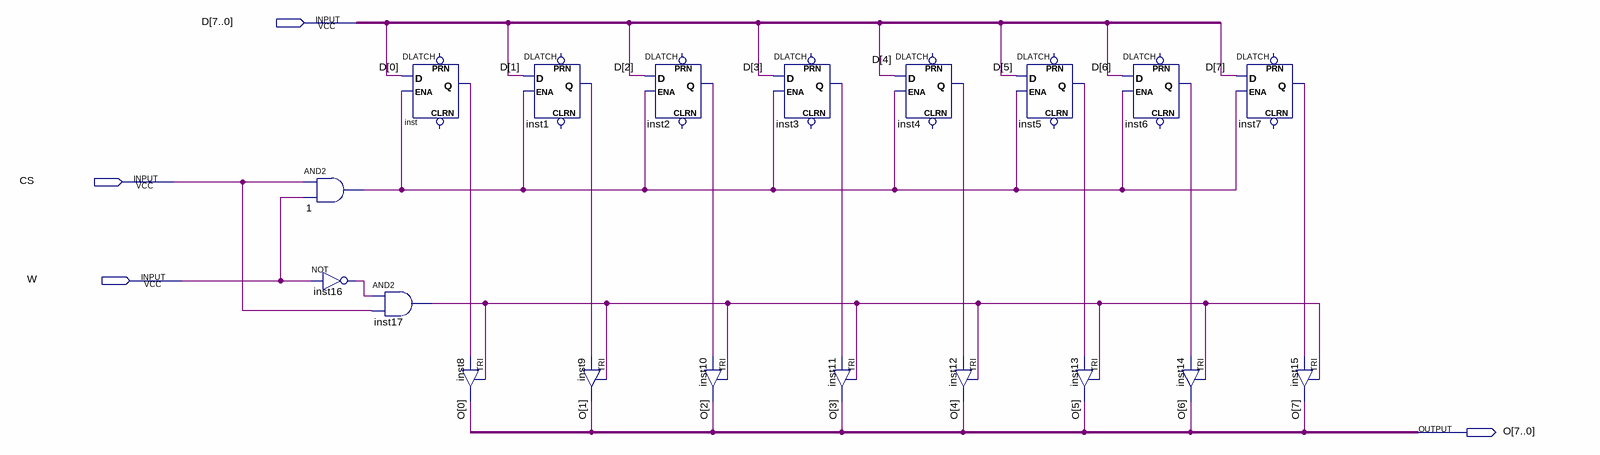
[diagram p0: schematic sheet]
// Quartus schematic WORD8BIT.bdf as structural Verilog: 19 symbols, 4 pins
module WORD8BIT (
  input  [7:0] D,
  input  CS,
  input  W,
  output [7:0] O
);

  wire inst1_q, inst2_q, inst3_q, inst4_q, inst5_q, inst6_q, inst7_q, inst16_out, inst17_out, inst_q, n1_out;

  and u_1 (n1_out, CS, W);
  not inst16 (inst16_out, W);
  and inst17 (inst17_out, inst16_out, CS);
  DLATCH inst (.D(D[0]), .ENA(n1_out), .Q(inst_q));  // open: CLRN, PRN
  TRI inst8 (.IN(inst_q), .OE(inst17_out), .OUT(O[0]));
  DLATCH inst1 (.D(D[1]), .ENA(n1_out), .Q(inst1_q));  // open: CLRN, PRN
  TRI inst9 (.IN(inst1_q), .OE(inst17_out), .OUT(O[1]));
  DLATCH inst2 (.D(D[2]), .ENA(n1_out), .Q(inst2_q));  // open: CLRN, PRN
  TRI inst10 (.IN(inst2_q), .OE(inst17_out), .OUT(O[2]));
  DLATCH inst3 (.D(D[3]), .ENA(n1_out), .Q(inst3_q));  // open: CLRN, PRN
  TRI inst11 (.IN(inst3_q), .OE(inst17_out), .OUT(O[3]));
  DLATCH inst4 (.D(D[4]), .ENA(n1_out), .Q(inst4_q));  // open: CLRN, PRN
  TRI inst12 (.IN(inst4_q), .OE(inst17_out), .OUT(O[4]));
  DLATCH inst5 (.D(D[5]), .ENA(n1_out), .Q(inst5_q));  // open: CLRN, PRN
  TRI inst13 (.IN(inst5_q), .OE(inst17_out), .OUT(O[5]));
  DLATCH inst6 (.D(D[6]), .ENA(n1_out), .Q(inst6_q));  // open: CLRN, PRN
  TRI inst14 (.IN(inst6_q), .OE(inst17_out), .OUT(O[6]));
  DLATCH inst7 (.D(D[7]), .ENA(n1_out), .Q(inst7_q));  // open: CLRN, PRN
  TRI inst15 (.IN(inst7_q), .OE(inst17_out), .OUT(O[7]));
endmodule
